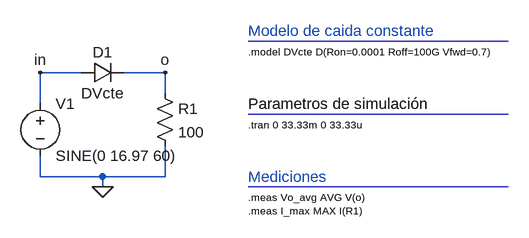
[diagram p0: schematic rectificador-media-onda_ejemplo1.asc]
rectificador-media-onda_ejemplo1.asc, the LTspice schematic file:
Version 4
SHEET 1 1376 680
WIRE 112 80 48 80
WIRE 240 80 176 80
WIRE 240 112 240 80
WIRE 48 128 48 80
WIRE 48 240 48 208
WIRE 144 240 48 240
WIRE 240 240 240 192
WIRE 240 240 144 240
WIRE 144 256 144 240
FLAG 144 256 0
FLAG 240 80 o
FLAG 48 80 in
SYMBOL diode 112 96 R270
WINDOW 0 32 32 VTop 2
WINDOW 3 0 32 VBottom 2
SYMATTR InstName D1
SYMATTR Value DVcte
SYMBOL voltage 48 112 R0
WINDOW 123 0 0 Left 0
WINDOW 39 0 0 Left 0
SYMATTR InstName V1
SYMATTR Value SINE(0 16.97 60)
SYMBOL res 224 96 R0
SYMATTR InstName R1
SYMATTR Value 100
TEXT 368 160 Left 1 !.tran 0 33.33m 0 33.33u
TEXT 368 48 Left 1 !.model DVcte D(Ron=0.0001 Roff=100G Vfwd=0.7)
TEXT 368 16 Left 2 ;Modelo de caida constante
TEXT 368 128 Left 2 !Parametros de simulación
TEXT 368 240 Left 2 ;Mediciones
TEXT 368 272 Left 1 !.meas Vo_avg AVG V(o)\n.meas I_max MAX I(R1)
LINE Normal 768 144 368 144
LINE Normal 768 144 768 144 2
LINE Normal 768 144 768 144 2
LINE Normal 768 256 368 256
LINE Normal 768 32 368 32

The netlist it stands for:
* rectificador-media-onda_ejemplo1.asc
D1 in o DVcte
V1 in 0 SINE(0 16.97 60)
R1 o 0 100
.model D D
.lib standard.dio
.tran 0 33.33m 0 33.33u
.model DVcte D(Ron=0.0001 Roff=100G Vfwd=0.7)
* Modelo de caida constante
Parametros de simulación
* Mediciones
.meas Vo_avg AVG V(o)
.meas I_max MAX I(R1)
.backanno
.end